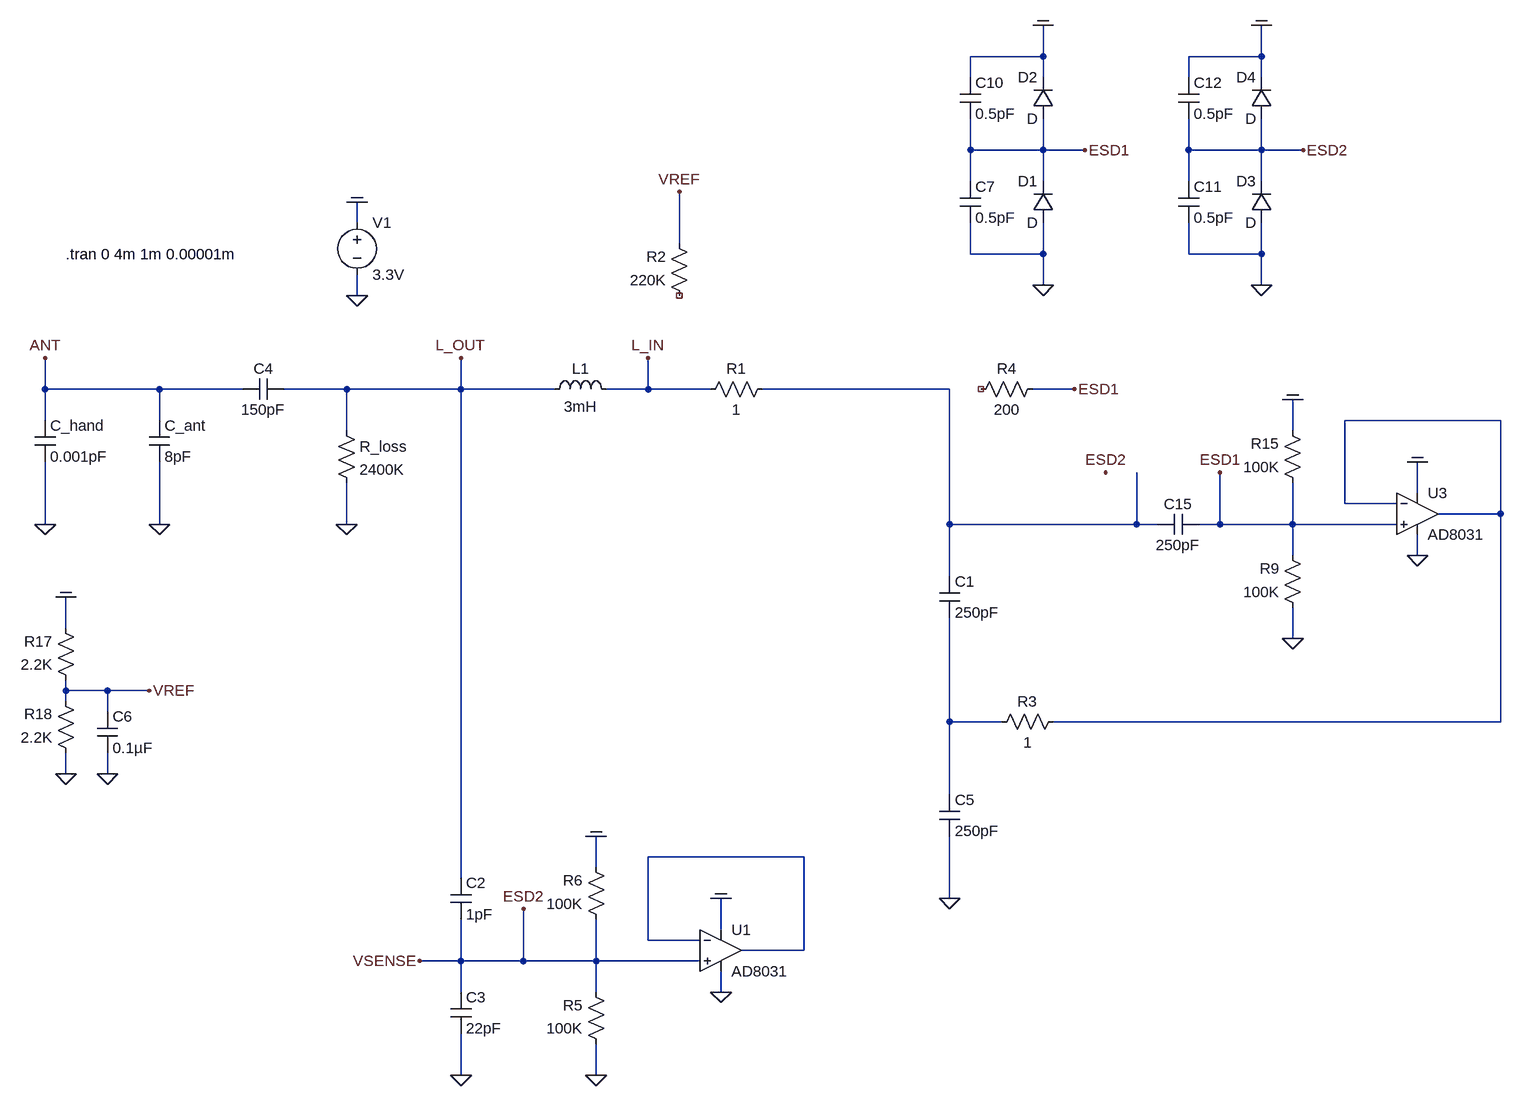
[diagram p0: schematic 2020_oscillator_experiments_v5.asc]
2020_oscillator_experiments_v5.asc, the LTspice schematic file:
Version 4
SHEET 1 3244 1620
WIRE 1056 -176 1056 -224
WIRE 1056 -176 944 -176
WIRE 1392 -176 1392 -224
WIRE 1392 -176 1280 -176
WIRE 944 -144 944 -176
WIRE 1056 -144 1056 -176
WIRE 1280 -144 1280 -176
WIRE 1392 -144 1392 -176
WIRE 944 -32 944 -80
WIRE 1056 -32 1056 -80
WIRE 1056 -32 944 -32
WIRE 1120 -32 1056 -32
WIRE 1280 -32 1280 -80
WIRE 1392 -32 1392 -80
WIRE 1392 -32 1280 -32
WIRE 1456 -32 1392 -32
WIRE 944 16 944 -32
WIRE 1056 16 1056 -32
WIRE 1280 16 1280 -32
WIRE 1392 16 1392 -32
WIRE 0 80 0 48
WIRE 496 112 496 32
WIRE 944 128 944 80
WIRE 1056 128 1056 80
WIRE 1056 128 944 128
WIRE 1280 128 1280 80
WIRE 1392 128 1392 80
WIRE 1392 128 1280 128
WIRE 1056 176 1056 128
WIRE 1392 176 1392 128
WIRE 0 192 0 160
WIRE -480 336 -480 288
WIRE -304 336 -480 336
WIRE -176 336 -304 336
WIRE -16 336 -112 336
WIRE 160 336 160 288
WIRE 160 336 -16 336
WIRE 304 336 160 336
WIRE 448 336 448 288
WIRE 448 336 384 336
WIRE 544 336 448 336
WIRE 912 336 624 336
WIRE 1104 336 1040 336
WIRE -480 384 -480 336
WIRE -304 384 -304 336
WIRE 1760 384 1520 384
WIRE -16 400 -16 336
WIRE 1440 400 1440 352
WIRE 1632 496 1632 448
WIRE 1520 512 1520 384
WIRE 1600 512 1520 512
WIRE 1760 528 1760 384
WIRE 1760 528 1664 528
WIRE -480 544 -480 448
WIRE -304 544 -304 448
WIRE -16 544 -16 480
WIRE 912 544 912 336
WIRE 1200 544 1200 464
WIRE 1200 544 912 544
WIRE 1232 544 1200 544
WIRE 1328 544 1328 464
WIRE 1328 544 1296 544
WIRE 1440 544 1440 480
WIRE 1440 544 1328 544
WIRE 1600 544 1440 544
WIRE 1440 592 1440 544
WIRE 1632 592 1632 560
WIRE 912 624 912 544
WIRE -448 704 -448 656
WIRE 1440 720 1440 672
WIRE -448 800 -448 784
WIRE -384 800 -448 800
WIRE -320 800 -384 800
WIRE -448 816 -448 800
WIRE -384 832 -384 800
WIRE 912 848 912 688
WIRE 992 848 912 848
WIRE 1760 848 1760 528
WIRE 1760 848 1072 848
WIRE -448 928 -448 896
WIRE -384 928 -384 896
WIRE 912 960 912 848
WIRE 688 1056 448 1056
WIRE 368 1072 368 1024
WIRE 160 1088 160 336
WIRE 912 1120 912 1024
WIRE 560 1168 560 1120
WIRE 448 1184 448 1056
WIRE 528 1184 448 1184
WIRE 688 1200 688 1056
WIRE 688 1200 592 1200
WIRE 160 1216 160 1152
WIRE 160 1216 96 1216
WIRE 256 1216 256 1136
WIRE 256 1216 160 1216
WIRE 368 1216 368 1152
WIRE 368 1216 256 1216
WIRE 528 1216 368 1216
WIRE 160 1264 160 1216
WIRE 368 1264 368 1216
WIRE 560 1264 560 1232
WIRE 160 1392 160 1328
WIRE 368 1392 368 1344
FLAG 0 192 0
FLAG 0 48 COM
FLAG -480 288 ANT
FLAG -480 544 0
FLAG -304 544 0
FLAG 160 1392 0
FLAG -16 544 0
FLAG 96 1216 VSENSE
FLAG 448 288 L_IN
FLAG 160 288 L_OUT
FLAG -448 928 0
FLAG -448 656 COM
FLAG -384 928 0
FLAG -320 800 VREF
FLAG 496 32 VREF
FLAG 1440 720 0
FLAG 1632 448 COM
FLAG 1632 592 0
FLAG 1440 352 COM
FLAG 1056 176 0
FLAG 1056 -224 COM
FLAG 1120 -32 ESD1
FLAG 1104 336 ESD1
FLAG 1392 176 0
FLAG 1392 -224 COM
FLAG 1456 -32 ESD2
FLAG 1152 464 ESD2
FLAG 912 1120 0
FLAG 1328 464 ESD1
FLAG 368 1392 0
FLAG 560 1120 COM
FLAG 560 1264 0
FLAG 368 1024 COM
FLAG 256 1136 ESD2
SYMBOL voltage 0 64 R0
WINDOW 123 0 0 Left 0
WINDOW 39 0 0 Left 0
SYMATTR InstName V1
SYMATTR Value 3.3V
SYMBOL ind 288 352 R270
WINDOW 0 32 56 VTop 2
WINDOW 3 5 56 VBottom 2
SYMATTR InstName L1
SYMATTR Value 3mH
SYMATTR SpiceLine Rser=120 Rpar=20Meg
SYMBOL cap 896 624 R0
SYMATTR InstName C1
SYMATTR Value 250pF
SYMBOL cap 144 1088 R0
SYMATTR InstName C2
SYMATTR Value 1pF
SYMBOL cap 144 1264 R0
SYMATTR InstName C3
SYMATTR Value 22pF
SYMBOL cap -320 384 R0
SYMATTR InstName C_ant
SYMATTR Value 8pF
SYMBOL cap -496 384 R0
SYMATTR InstName C_hand
SYMATTR Value 0.001pF
SYMBOL cap -112 320 R90
WINDOW 0 0 32 VBottom 2
WINDOW 3 32 32 VTop 2
SYMATTR InstName C4
SYMATTR Value 150pF
SYMBOL res -32 384 R0
SYMATTR InstName R_loss
SYMATTR Value 2400K
SYMBOL res 640 320 R90
WINDOW 0 0 56 VBottom 2
WINDOW 3 32 56 VTop 2
SYMATTR InstName R1
SYMATTR Value 1
SYMBOL res 512 208 R180
WINDOW 0 36 76 Left 2
WINDOW 3 36 40 Left 2
SYMATTR InstName R2
SYMATTR Value 220K
SYMBOL res -432 800 R180
WINDOW 0 36 76 Left 2
WINDOW 3 36 40 Left 2
SYMATTR InstName R17
SYMATTR Value 2.2K
SYMBOL res -432 912 R180
WINDOW 0 36 76 Left 2
WINDOW 3 36 40 Left 2
SYMATTR InstName R18
SYMATTR Value 2.2K
SYMBOL cap -400 832 R0
SYMATTR InstName C6
SYMATTR Value 0.1µF
SYMBOL res 1456 688 R180
WINDOW 0 36 76 Left 2
WINDOW 3 36 40 Left 2
SYMATTR InstName R9
SYMATTR Value 100K
SYMBOL Opamps\\AD8031 1632 464 R0
SYMATTR InstName U3
SYMBOL cap 896 960 R0
SYMATTR InstName C5
SYMATTR Value 250pF
SYMBOL res 1456 496 R180
WINDOW 0 36 76 Left 2
WINDOW 3 36 40 Left 2
SYMATTR InstName R15
SYMATTR Value 100K
SYMBOL res 976 864 R270
WINDOW 0 32 56 VTop 2
WINDOW 3 0 56 VBottom 2
SYMATTR InstName R3
SYMATTR Value 1
SYMBOL diode 1072 80 R180
WINDOW 0 24 64 Left 2
WINDOW 3 24 0 Left 2
SYMATTR InstName D1
SYMBOL diode 1072 -80 R180
WINDOW 0 24 64 Left 2
WINDOW 3 24 0 Left 2
SYMATTR InstName D2
SYMBOL res 1056 320 R90
WINDOW 0 0 56 VBottom 2
WINDOW 3 32 56 VTop 2
SYMATTR InstName R4
SYMATTR Value 200
SYMBOL cap 928 16 R0
SYMATTR InstName C7
SYMATTR Value 0.5pF
SYMBOL cap 928 -144 R0
SYMATTR InstName C10
SYMATTR Value 0.5pF
SYMBOL diode 1408 80 R180
WINDOW 0 24 64 Left 2
WINDOW 3 24 0 Left 2
SYMATTR InstName D3
SYMBOL diode 1408 -80 R180
WINDOW 0 24 64 Left 2
WINDOW 3 24 0 Left 2
SYMATTR InstName D4
SYMBOL cap 1264 16 R0
SYMATTR InstName C11
SYMATTR Value 0.5pF
SYMBOL cap 1264 -144 R0
SYMATTR InstName C12
SYMATTR Value 0.5pF
SYMBOL cap 1296 528 R90
WINDOW 0 0 32 VBottom 2
WINDOW 3 32 32 VTop 2
SYMATTR InstName C15
SYMATTR Value 250pF
SYMBOL res 384 1360 R180
WINDOW 0 36 76 Left 2
WINDOW 3 36 40 Left 2
SYMATTR InstName R5
SYMATTR Value 100K
SYMBOL Opamps\\AD8031 560 1136 R0
SYMATTR InstName U1
SYMBOL res 384 1168 R180
WINDOW 0 36 76 Left 2
WINDOW 3 36 40 Left 2
SYMATTR InstName R6
SYMATTR Value 100K
TEXT -448 128 Left 2 !.tran 0 4m 1m 0.00001m

The netlist it stands for:
* 2020_oscillator_experiments_v5.asc
V1 COM 0 3.3V
L1 L_OUT L_IN 3mH Rser=120 Rpar=20Meg
C1 N001 N003 250pF
C2 L_OUT ESD2 1pF
C3 ESD2 0 22pF
C_ant ANT 0 8pF
C_hand ANT 0 0.001pF
C4 L_OUT ANT 150pF
R_loss L_OUT 0 2400K
R1 N001 L_IN 1
R2 NC_01 VREF 220K
R17 VREF COM 2.2K
R18 0 VREF 2.2K
C6 VREF 0 0.1µF
R9 0 ESD1 100K
XU3 ESD1 N002 COM 0 N002 AD8031  ; pins In+ In- V+ V- OUT
C5 N003 0 250pF
R15 ESD1 COM 100K
R3 N003 N002 1
D1 0 ESD1 D
D2 ESD1 COM D
R4 ESD1 NC_02 200
C7 ESD1 0 0.5pF
C10 COM ESD1 0.5pF
D3 0 ESD2 D
D4 ESD2 COM D
C11 ESD2 0 0.5pF
C12 COM ESD2 0.5pF
C15 ESD1 N001 250pF
R5 0 ESD2 100K
XU1 ESD2 N004 COM 0 N004 AD8031  ; pins In+ In- V+ V- OUT
R6 ESD2 COM 100K
.model D D
.lib standard.dio
.tran 0 4m 1m 0.00001m
.backanno
.end